# Altium schematic sheet auxPower.SchDoc
size A4
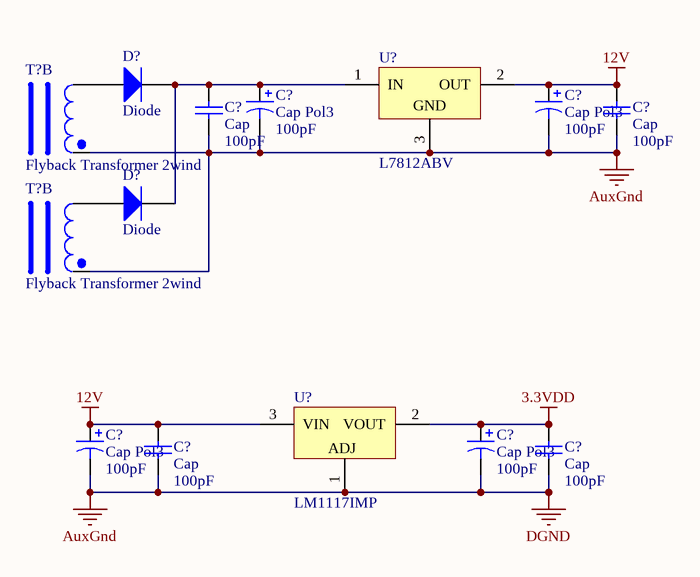
[diagram p0: auxPower.SchDoc]

## Parts
(Parts that share a designator on the sheet are numbered #1, #2 ... from top to bottom, then left to right.)
C?#1  Cap Pol3  value 100pF  [C0805]
C?#2  Cap Pol3  value 100pF  [C0805]
C?#3  Cap  value 100pF  [RAD-0.3]
C?#4  Cap  value 100pF  [RAD-0.3]
C?#5  Cap Pol3  value 100pF  [C0805]
C?#6  Cap Pol3  value 100pF  [C0805]
C?#7  Cap  value 100pF  [RAD-0.3]
C?#8  Cap  value 100pF  [RAD-0.3]
D?#1  Diode  [SMC]
D?#2  Diode  [SMC]
T?#1  Flyback Transformer 2wind  (part B of 2)
T?#2  Flyback Transformer 2wind  (part B of 2)
U?#1  L7812ABV  [TO220ABN]
U?#2  LM1117IMP

## Nets
3.3VDD: C?#6.1 C?#8.2 U?#2.2(VOUT)
12V: C?#2.1 C?#4.2 C?#5.1 C?#7.2 U?#1.2(OUT) U?#2.3(VIN)
AuxGnd: C?#1.2 C?#2.2 C?#3.1 C?#4.1 C?#5.2 C?#6.2 C?#7.1 C?#8.1 T?#1.4 T?#2.4 U?#1.3(GND) U?#2.1(ADJ)  [also labelled DGND]
NetC?#1_1: C?#1.1 C?#3.2 D?#1.2(K) D?#2.2(K) U?#1.1(IN)
NetD?#1_1: D?#1.1(A) T?#1.3
NetD?#2_1: D?#2.1(A) T?#2.3

Not connected (* = marked no-connect by the designer): U?#2 4(TAB)

## Notes on the sheet
- Title
- Size:
- Date:
- A4
- Number:
- Time:
- Revision:
- Sheet
- of
- File:

## Library data of the parts
C?#1 C?#2 C?#5 C?#6 = Cap Pol3: Polarized Capacitor (Surface Mount); Published: 8-Jun-2000; LatestRevisionDate: 29-May-2009; LatestRevisionNote: IPC-7351 Footprint Added.; PackageReference: C0805; Publisher: Altium Limited; PackageDescription: Chip Capacitor
C?#3 C?#4 C?#7 C?#8 = Cap: Capacitor; Published: 8-Jun-2000; LatestRevisionDate: 17-Jul-2002; LatestRevisionNote: Re-released for DXP Platform.; PackageReference: RAD-0.3; Publisher: Altium Limited; PackageDescription: Radial Cap, Thru-Hole; 2 Leads; 0.3 in Pin Spacing
D?#1 D?#2 = Diode: Default Diode; Published: 8-Jun-2000; LatestRevisionDate: 17-Jul-2002; LatestRevisionNote: Re-released for DXP Platform.; PackageVersion: Sep-1996; PackageReference: SMC; Publisher: Altium Limited; PackageDescription: DO-214-AB/SMC; 2 C-Bend Leads; Body 7.9 x 5.9 mm, inc. leads (LxW); Code_JEDEC: DO-214-AB
U?#1 = L7812ABV: Precision 1A Regulator; Published: 24-Aug-2001; LatestRevisionDate: 17-Jul-2002; LatestRevisionNote: Re-released for DXP Platform.; DatasheetVersion: Nov-1999; PackageVersion: Jun-1998; PackageReference: TO220ABN; Publisher: Altium Limited; PackageDescription: TO, Thru-Hole, Vertical, Heatsink Mounted; 3 In-Line Leads; Pitch 2.54 mm; Pin sequence 1, 3, 2; ComponentLink1Description: Manufacturer Link; ComponentLink1URL: http://www.st.com/; ComponentLink2Description: Datasheet; ComponentLink2URL: http://www.st.com/stonline/products/literature/ds/2144/l7805ab.pdf